# Altium schematic sheet Sheet1.SchDoc
size A4; SheetNumber: 1; SheetTotal: 1
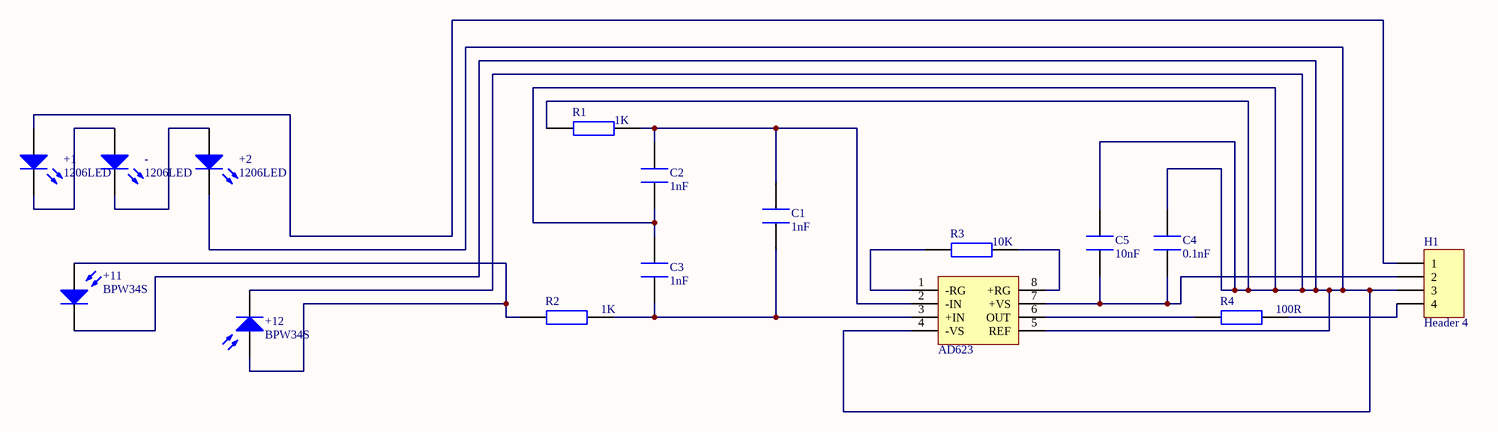
[diagram p0: Sheet1.SchDoc]

## Parts
+1  1206LED  [3.2X1.6X1.1]
+2  1206LED  [3.2X1.6X1.1]
+11  BPW34S  [BPW34S]
+12  BPW34S  [BPW34S]
-  1206LED  [3.2X1.6X1.1]
C1  1nF  [0402]
C2  1nF  [0402]
C3  1nF  [0402]
C4  0.1nF  [0402]
C5  10nF  [0402]
H1  Header 4  [HDR1X4]
R1  1K  [0402-A]
R2  1K  [0402-A]
R3  10K  [0402-A]
R4  100R  [0402-A]
U1  AD623  [SO8_M]

## Nets
Net+1_1: +1.1(A) H1.1
Net+1_2: +1.2(K) -.1(A)
Net+2_1: +2.1(A) -.2(K)
Net+2_2: +2.2(K) +11.2(K) +12.2(K) C2.1 C3.2 C4.2 C5.2 H1.3 R1.1 U1.4(-VS) U1.5(REF)
Net+11_1: +11.1(A) +12.1(A) R2.1
NetC1_1: C1.1 C3.1 R2.2 U1.3(+IN)
NetC1_2: C1.2 C2.2 R1.2 U1.2(-IN)
NetC4_1: C4.1 C5.1 H1.2 U1.7(+VS)
NetH1_4: H1.4 R4.2
NetR3_1: R3.1 U1.1(-RG)
NetR3_2: R3.2 U1.8(+RG)
NetR4_1: R4.1 U1.6(OUT)

## Library data of the parts
+1 +2 - = LED0: Typical INFRARED GaAs LED; Published: 8-Jun-2000; LatestRevisionDate: 08-Jul-2005; LatestRevisionNote: Mech Layer 1 removed.; PackageReference: LED-0; Publisher: Altium Limited; PackageDescription: LED; 2 Leads
+11 +12 = Photo Sen: Photosensitive Diode; Published: 24-Mar-1999; LatestRevisionDate: 17-Jul-2002; LatestRevisionNote: Re-released for DXP Platform.; PackageReference: PIN2; Publisher: Altium Limited
C1-C5 = CAP: 电容
H1 = Header 4: Header, 4-Pin; LatestRevisionDate: 17-Jul-2002; LatestRevisionNote: Re-released for DXP Platform.; Publisher: Altium Limited
R1-R4 = RES: 电阻
U1 = AD623: IC